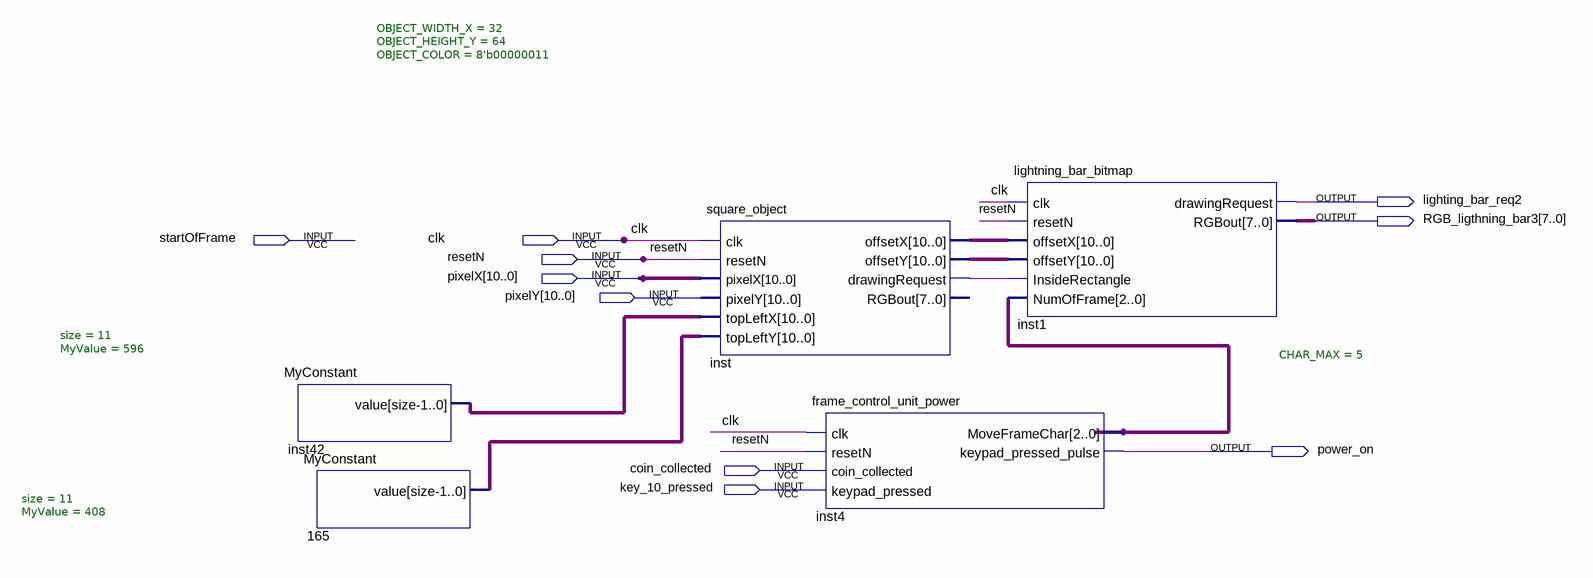
[diagram p0: schematic sheet]
// Quartus schematic lightning_bar.bdf as structural Verilog: 5 symbols, 10 pins
module lightning_bar (
  input  startOfFrame,
  input  clk,
  input  resetN,
  input  [10:0] pixelX,
  input  [10:0] pixelY,
  input  coin_collected,
  input  key_10_pressed,
  output lighting_bar_req2,
  output [7:0] RGB_ligthning_bar3,
  output power_on
);

  wire inst_drawingrequest;
  wire [2:0] inst4_moveframechar;
  wire [10:0] inst42_value, inst_offsetx, inst_offsety, n165_value;

  MyConstant #(.size(11), .MyValue(596)) inst42 (.value(inst42_value));
  MyConstant #(.size(11), .MyValue(408)) u_165 (.value(n165_value));
  square_object #(.OBJECT_WIDTH_X(32), .OBJECT_HEIGHT_Y(64), .OBJECT_COLOR(8'b00000011)) inst (
    .clk(clk), .resetN(resetN), .pixelX(pixelX), .pixelY(pixelY), .topLeftX(inst42_value),
    .topLeftY(n165_value), .offsetX(inst_offsetx), .offsetY(inst_offsety),
    .drawingRequest(inst_drawingrequest));  // open: RGBout
  frame_control_unit_power #(.CHAR_MAX(5)) inst4 (
    .clk(clk), .resetN(resetN), .coin_collected(coin_collected), .keypad_pressed(key_10_pressed),
    .MoveFrameChar(inst4_moveframechar), .keypad_pressed_pulse(power_on));
  lightning_bar_bitmap inst1 (
    .clk(clk), .resetN(resetN), .offsetX(inst_offsetx), .offsetY(inst_offsety),
    .InsideRectangle(inst_drawingrequest), .NumOfFrame(inst4_moveframechar),
    .drawingRequest(lighting_bar_req2), .RGBout(RGB_ligthning_bar3));
endmodule
